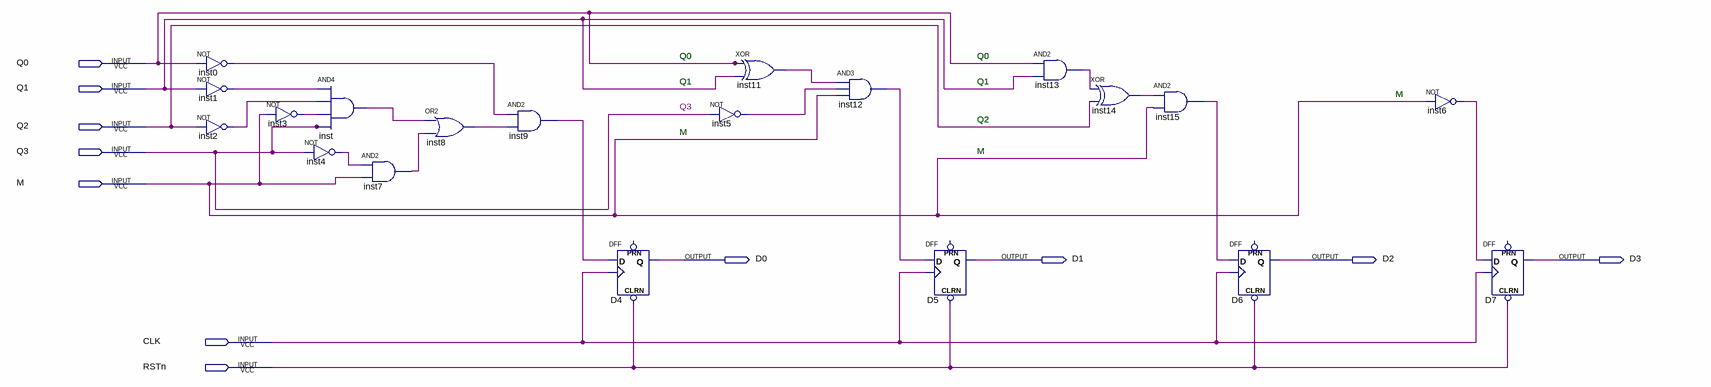
[diagram p0: schematic sheet]
// Quartus schematic Estados.bdf as structural Verilog: 20 symbols, 11 pins
module Estados (
  input  Q0,
  input  Q1,
  input  Q2,
  input  Q3,
  input  M,
  input  CLK,
  input  RSTn,
  output D0,
  output D1,
  output D2,
  output D3
);

  wire inst0_out, inst1_out, inst2_out, inst3_out, inst4_out, inst5_out, inst6_out, inst7_out, inst8_out,
       inst9_out, inst11_out, inst12_out, inst13_out, inst14_out, inst15_out, inst_out;

  not inst0 (inst0_out, Q0);
  not inst1 (inst1_out, Q1);
  not inst2 (inst2_out, Q2);
  not inst3 (inst3_out, M);
  not inst4 (inst4_out, Q3);
  and inst (inst_out, inst1_out, inst2_out, inst3_out, Q3);
  and inst7 (inst7_out, inst4_out, M);
  or inst8 (inst8_out, inst_out, inst7_out);
  and inst9 (inst9_out, inst0_out, inst8_out);
  DFF D4 (.CLRN(RSTn), .CLK(CLK), .D(inst9_out), .Q(D0));  // open: PRN
  not inst5 (inst5_out, Q3);
  xor inst11 (inst11_out, Q0, Q1);
  and inst12 (inst12_out, inst11_out, inst5_out, M);
  DFF D5 (.CLRN(RSTn), .CLK(CLK), .D(inst12_out), .Q(D1));  // open: PRN
  and inst13 (inst13_out, Q0, Q1);
  xor inst14 (inst14_out, inst13_out, Q2);
  and inst15 (inst15_out, inst14_out, M);
  DFF D6 (.CLRN(RSTn), .CLK(CLK), .D(inst15_out), .Q(D2));  // open: PRN
  not inst6 (inst6_out, M);
  DFF D7 (.CLRN(RSTn), .CLK(CLK), .D(inst6_out), .Q(D3));  // open: PRN

  // Notes on the sheet:
  //   Q0
  //   Q0
  //   Q1
  //   Q1
  //   M
  //   M
  //   Q3
  //   Q2
  //   M
  //   M
endmodule
